# EAGLE design queencontroller (EAGLE 7.3.0)
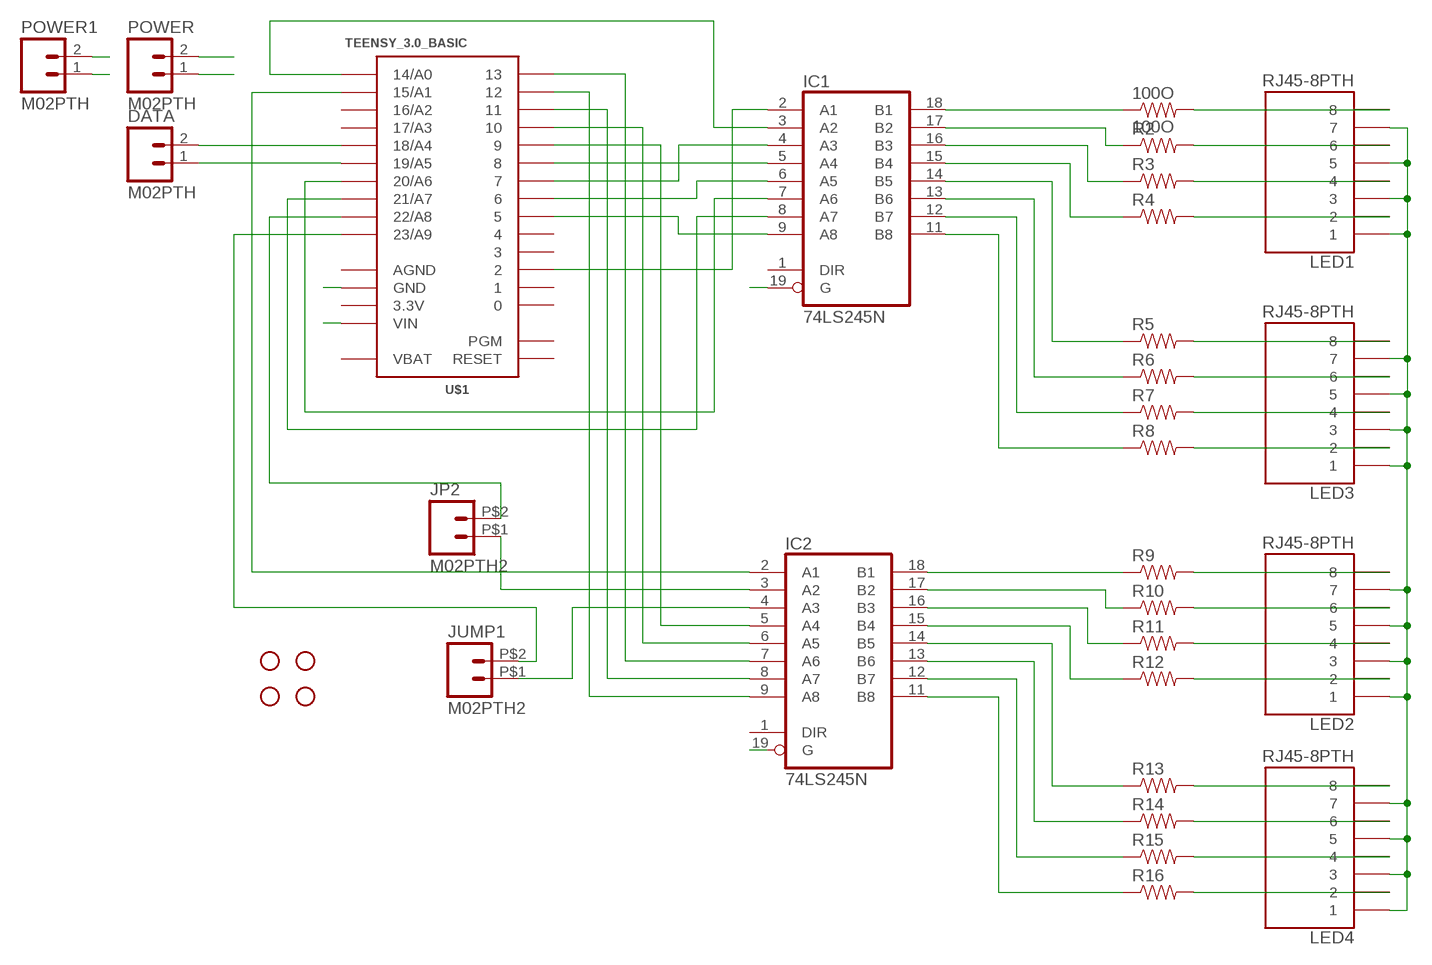
[diagram p0: schematic, sheet 1]

## Parts
100O  100O  RESISTOR1206  [1206]
DATA  M02PTH  [1X02]
IC1  74LS245N  [DIL20]
IC2  74LS245N  [DIL20]
JP2  M02PTH2  [1X02_BIG]
JUMP1  M02PTH2  [1X02_BIG]
LED1  RJ45-8PTH  [RJ45-8]
LED2  RJ45-8PTH  [RJ45-8]
LED3  RJ45-8PTH  [RJ45-8]
LED4  RJ45-8PTH  [RJ45-8]
POWER  M02PTH  [1X02]
POWER1  M02PTH  [1X02]
R2  RESISTOR1206  [1206]
R3  RESISTOR1206  [1206]
R4  RESISTOR1206  [1206]
R5  RESISTOR1206  [1206]
R6  RESISTOR1206  [1206]
R7  RESISTOR1206  [1206]
R8  RESISTOR1206  [1206]
R9  RESISTOR1206  [1206]
R10  RESISTOR1206  [1206]
R11  RESISTOR1206  [1206]
R12  RESISTOR1206  [1206]
R13  RESISTOR1206  [1206]
R14  RESISTOR1206  [1206]
R15  RESISTOR1206  [1206]
R16  RESISTOR1206  [1206]
STANDOFF1  STAND-OFF  [STAND-OFF]
STANDOFF2  STAND-OFF  [STAND-OFF]
STANDOFF3  STAND-OFF  [STAND-OFF]
STANDOFF4  STAND-OFF  [STAND-OFF]
U$1  TEENSY_3.0_BASIC  [TEENSY_3.0_BASIC]

## Nets
GND: IC1.19(G) IC2.19(G) LED1.1 LED1.3 LED1.5 LED1.7 LED2.1 LED2.3 LED2.5 LED2.7 LED3.1 LED3.3 LED3.5 LED3.7 LED4.1 LED4.3 LED4.5 LED4.7 POWER1.1 POWER.1 U$1.GND U$1.GND1(GND)
JMP1: JUMP1.P$2 U$1.23/A9
JMP2: JP2.P$2 U$1.22/A8
N$1: 100O.2 LED1.8
N$2: LED1.6 R2.2
N$3: LED1.4 R3.2
N$4: LED1.2 R4.2
N$5: LED3.8 R5.2
N$6: LED3.6 R6.2
N$7: LED3.4 R7.2
N$8: LED3.2 R8.2
N$9: LED2.8 R9.2
N$10: LED2.6 R10.2
N$11: LED2.4 R11.2
N$12: LED2.2 R12.2
N$13: LED4.8 R13.2
N$14: LED4.6 R14.2
N$15: LED4.4 R15.2
N$16: LED4.2 R16.2
N$17: IC1.2(A1) U$1.2
N$18: IC1.3(A2) U$1.14/A0
N$19: IC1.4(A3) U$1.7
N$20: IC1.5(A4) U$1.8
N$21: IC1.6(A5) U$1.6
N$22: IC1.7(A6) U$1.20/A6
N$23: IC1.8(A7) U$1.21/A7
N$24: IC1.9(A8) U$1.5
N$25: IC2.2(A1) U$1.15/A1
N$26: IC2.3(A2) JP2.P$1
N$27: IC2.4(A3) JUMP1.P$1
N$28: IC2.5(A4) U$1.9
N$29: IC2.6(A5) U$1.10
N$30: IC2.7(A6) U$1.13
N$31: IC2.8(A7) U$1.11
N$32: IC2.9(A8) U$1.12
N$33: 100O.1 IC1.18(B1)
N$34: IC1.17(B2) R2.1
N$35: IC1.16(B3) R3.1
N$36: IC1.15(B4) R4.1
N$37: IC1.14(B5) R5.1
N$38: IC1.13(B6) R6.1
N$39: IC1.12(B7) R7.1
N$40: IC1.11(B8) R8.1
N$41: IC2.18(B1) R9.1
N$42: IC2.17(B2) R10.1
N$43: IC2.16(B3) R11.1
N$44: IC2.15(B4) R12.1
N$45: IC2.14(B5) R13.1
N$46: IC2.13(B6) R14.1
N$47: IC2.12(B7) R15.1
N$48: IC2.11(B8) R16.1
SCL: DATA.1 U$1.19/A5
SDA: DATA.2 U$1.18/A4
VCC: POWER1.2 POWER.2 U$1.VIN
Unconnected: IC1.1(DIR) IC2.1(DIR) U$1.0 U$1.1 U$1.3 U$1.4 U$1.16/A2 U$1.17/A3 U$1.PGM U$1.RESET

## Power pins joined to a net without a drawn wire
3.3V: U$1.3.3V U$1.3.3V1(3.3V)
AGND: U$1.AGND
GND: IC1.10(GND) IC2.10(GND)
VBAT: U$1.VBAT
VCC: IC1.20(VCC) IC2.20(VCC)

## Library data of the parts
100O R2-R16 = SparkFun-Passives:RESISTOR: Resistor Basic schematic elements and footprints for 0603, 1206, and PTH resistors.
DATA JP2 JUMP1 POWER POWER1 = SparkFun-Connectors:M02: Standard 2-pin 0.1" header. Use with - straight break away headers ( PRT-00116) - right angle break away headers (PRT-00553) - swiss pins (PRT-00743) - machine pins (PRT-00117) - female headers (PRT-00115) Molex polarized connector foot print use with: PRT-08233 with associated crimp pins and housings. 2.54_SCREWTERM for use with PRT-10571. 3.5mm Screw Terminal footprints for PRT-08084 5mm Screw Terminal footprints for use with PRT-08432
IC1 IC2 = 74xx-us:74*245: Octal BUS TRANSCEIVER, 3-state
LED1-LED4 = SparkFun-Connectors:RJ45-8: RJ45 Jack Simple RJ45, 8-pin connection - connector for common Cat5, Cat5e, and Cat6 Ethernet cables. Footprint not yet proven in production. Connector sku is PRT-00643; Breakout PCB sku is BOB-00716.
STANDOFF1-STANDOFF4 = SparkFun-Electromechanical:STAND-OFF: #4 Stand Off This is the mechanical footprint for a #4 phillips button head screw. Use the keepout ring to avoid running the screw head into surrounding components. SKU : PRT-00447
U$1 = Teensy3.0:TEENSY_3.0_BASIC: Basic Teensy 3.0 with none of the 'inner' pins enabled. See '+4', 'AllAnalogPins", and 'AllPins' packages for additional pin holes, as needed.

## Board
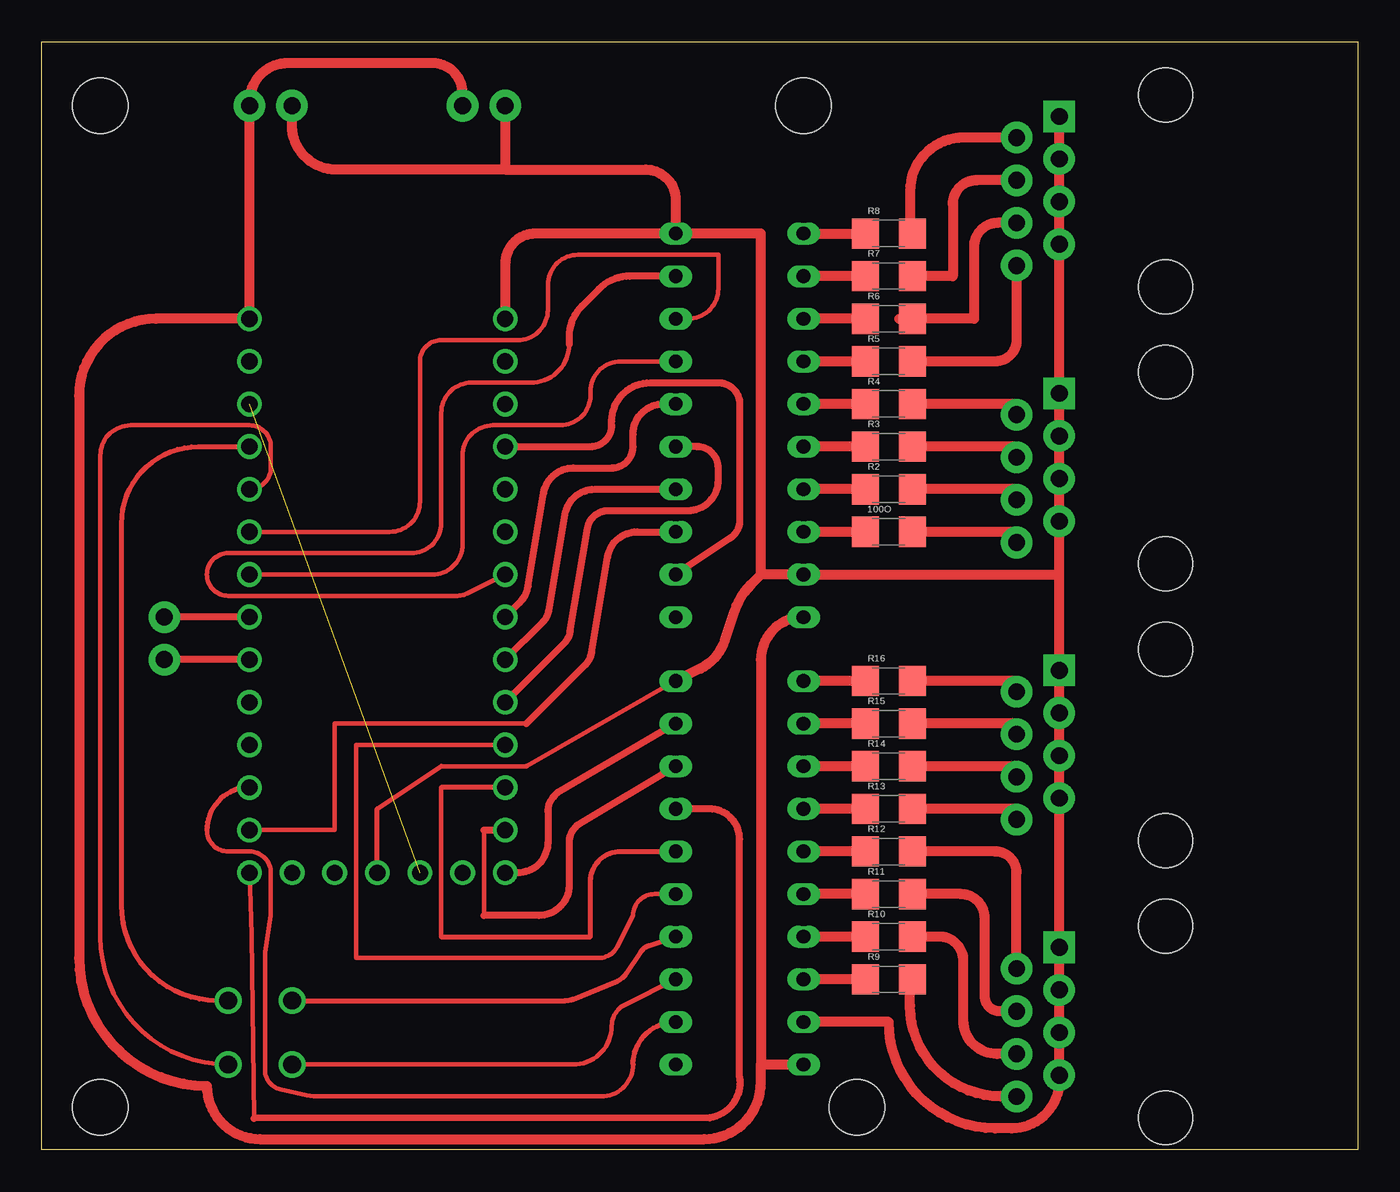
[diagram p1: board, top side]
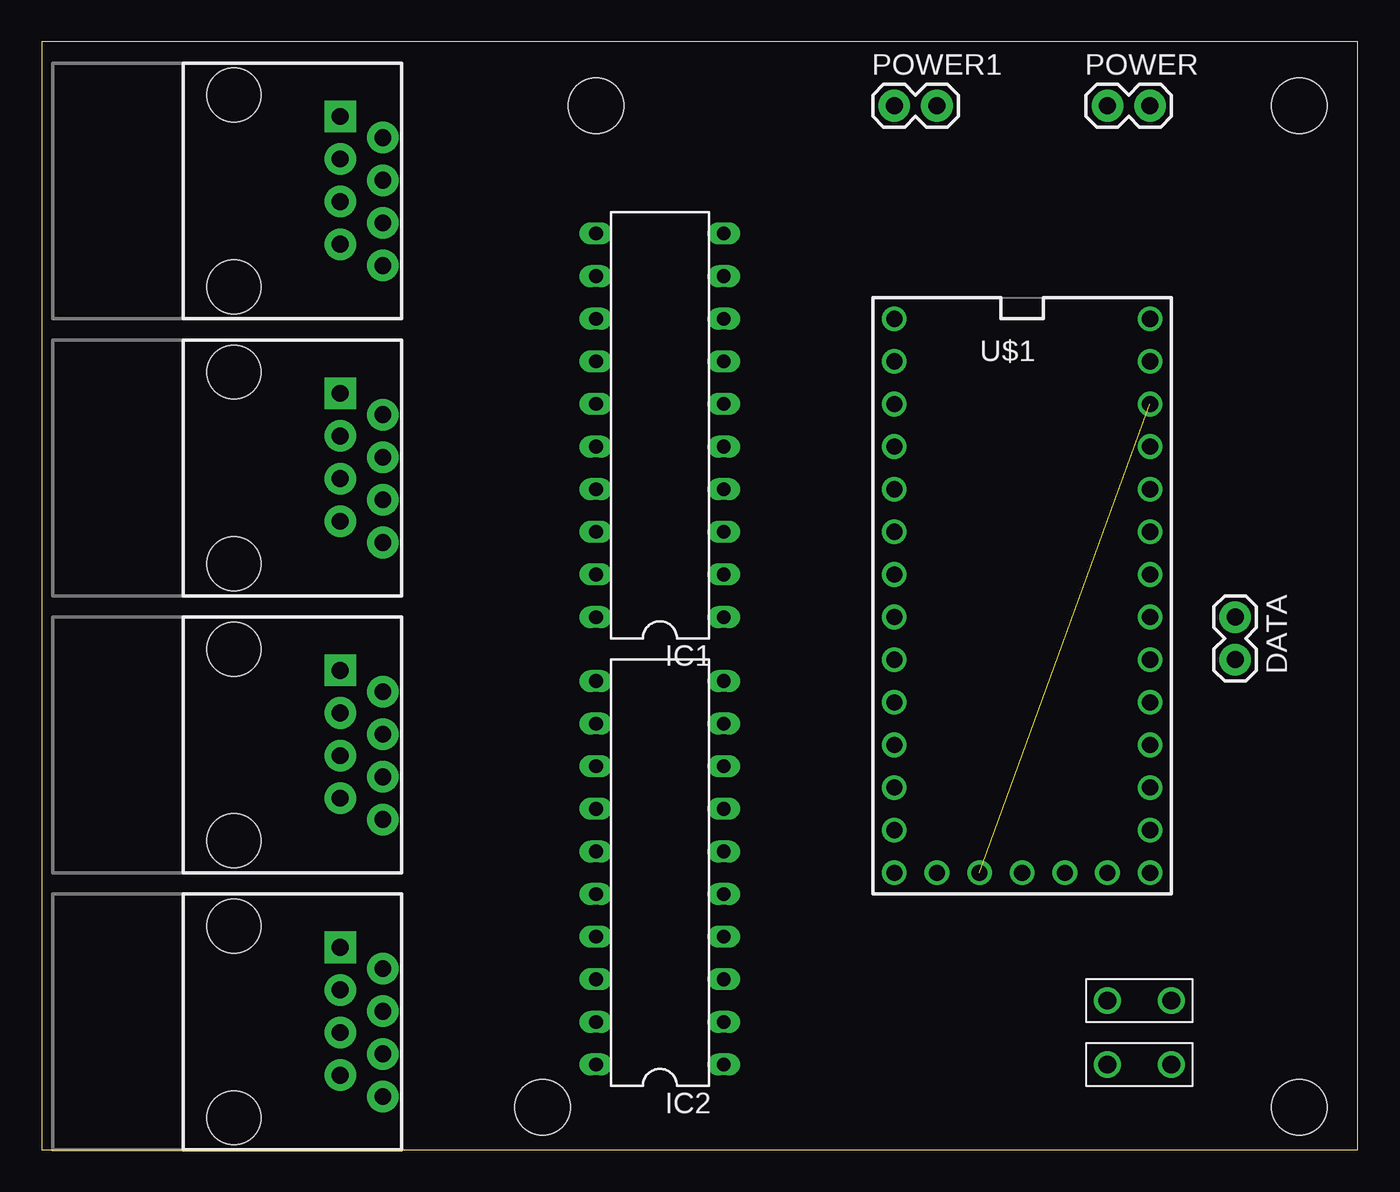
[diagram p2: board, bottom side, seen from below]

Size 78.41 x 66.03 mm. Coordinates in mm from the lower left corner, seen from the top.
Outline: 78.41,0 0,0 0,66.03 78.41,66.03 78.41,0
Copper layers (1*16): Top 0.035mm / dielectric 1.5mm / Bottom 0.035mm
Design rules "Othermill-DRC-1-64": minimum track width 8mil, minimum drill 0.8mm, track to track 0.39878125mm, track to pad 0.39878125mm, pad to pad 0.39878125mm, via to via 0.39878125mm, smd to smd 0mil, copper to edge 0mil, drill to drill 1mil, minimum pad ring 10mil, minimum via ring 10mil, stop-mask expansion 1mil, vias tented up to drill 30mil, thermal gap 10mil

### Footprints (pad centres in the part's own frame; a part is rotated, then mirrored left to right if it is on the bottom)
1206 = smd 1.6 x 1.8: 1 -1.4,0; 2 1.4,0
1X02 = drill 1.016 pad 1.88: 1 0,0; 2 2.54,0
DIL20 = drill 0.813 long: 1 -11.43,-3.81; 2 -8.89,-3.81; 3 -6.35,-3.81; 4 -3.81,-3.81; 5 -1.27,-3.81; 6 1.27,-3.81; 7 3.81,-3.81; 8 6.35,-3.81; 9 8.89,-3.81; 10 11.43,-3.81; 11 11.43,3.81; 12 8.89,3.81; 13 6.35,3.81; 14 3.81,3.81; 15 1.27,3.81; 16 -1.27,3.81; 17 -3.81,3.81; 18 -6.35,3.81; 19 -8.89,3.81; 20 -11.43,3.81
1X02_BIG = drill 1.067: P$1 0,0; P$2 3.81,0
RJ45-8 = drill 1 pad 1.88 square: 1 -4.445,6.35 | drill 1 pad 1.88: 2 -3.175,8.89; 3 -1.905,6.35; 4 -0.635,8.89; 5 0.635,6.35; 6 1.905,8.89; 7 3.175,6.35; 8 4.445,8.89 | hole 3.2: -5.715,0; 5.715,0
STAND-OFF = hole 3.302: 0,0
TEENSY_3.0_BASIC = drill 0.965: 0 -7.62,13.97; 1 -7.62,11.43; 2 -7.62,8.89; 3 -7.62,6.35; 3.3V 7.62,11.43; 3.3V1 -2.54,-16.51; 4 -7.62,3.81; 5 -7.62,1.27; 6 -7.62,-1.27; 7 -7.62,-3.81; 8 -7.62,-6.35; 9 -7.62,-8.89; 10 -7.62,-11.43; 11 -7.62,-13.97; 12 -7.62,-16.51; 13 7.62,-16.51; 14/A0 7.62,-13.97; 15/A1 7.62,-11.43; 16/A2 7.62,-8.89; 17/A3 7.62,-6.35; 18/A4 7.62,-3.81; 19/A5 7.62,-1.27; 20/A6 7.62,1.27; 21/A7 7.62,3.81; 22/A8 7.62,6.35; 23/A9 7.62,8.89; AGND 7.62,13.97; GND -7.62,16.51; GND1 0,-16.51; PGM 2.54,-16.51; RESET 5.08,-16.51; VBAT -5.08,-16.51; VIN 7.62,16.51

### Placement (x,y rotation side)
100O  50.47,36.83 0 top
DATA  7.29,31.75 270 bottom
IC1  41.58,43.18 90 bottom
IC2  41.58,16.51 90 bottom
JP2  14.91,5.08 0 bottom
JUMP1  14.91,8.89 0 bottom
LED1  66.98,40.64 270 bottom
LED2  66.98,7.62 270 bottom
LED3  66.98,57.15 270 bottom
LED4  66.98,24.13 270 bottom
POWER  14.91,62.23 0 bottom
POWER1  27.61,62.23 0 bottom
R2  50.47,39.37 0 top
R3  50.47,41.91 0 top
R4  50.47,44.45 0 top
R5  50.47,46.99 0 top
R6  50.47,49.53 0 top
R7  50.47,52.07 0 top
R8  50.47,54.61 0 top
R9  50.47,10.16 0 top
R10  50.47,12.7 0 top
R11  50.47,15.24 0 top
R12  50.47,17.78 0 top
R13  50.47,20.32 0 top
R14  50.47,22.86 0 top
R15  50.47,25.4 0 top
R16  50.47,27.94 0 top
STANDOFF1  3.48,2.54 0 top
STANDOFF2  48.57,2.54 0 top
STANDOFF3  3.48,62.23 0 top
STANDOFF4  45.39,62.23 0 top
U$1  19.99,33.02 0 bottom

### Tracks (layer width: path | path; a pad name or v marks a point on that pad's centre or on a via)
3.3V  (1 unrouted)
GND
  Top 0.254: 23.8,22.86 28.88,22.86
  Top 0.305: U$1.GND1 19.99,20.32 23.8,22.86 | IC2.10 28.88,22.86
  Top 0.61: 42.85,34.29 IC1.19 60.63,34.29 | 42.85,34.29 42.85,54.61 IC1.10 | 42.85,34.29 42.25,33.69 arc27 41.28,32.12 40.68,30.33 arc-45 39.26,28.68 IC2.10 | IC2.19 50.47,7.62 arc90 56.82,1.27 57.79,1.27 arc90 60.63,4.11 LED2.7 LED2.5 LED2.3 LED2.1 LED4.7 LED4.5 LED4.3 LED4.1 60.63,34.29 | 60.63,34.29 LED1.7 LED1.5 LED1.3 LED1.1 LED3.7 LED3.5 LED3.3 LED3.1 | POWER1.1 27.61,58.42 | 27.61,58.42 17.53,58.42 arc-90 14.91,61.04 POWER.1 | 27.61,58.42 35.97,58.42 arc-90 37.77,56.62 IC1.10 | IC1.10 29.41,54.61 arc90 27.61,52.81 U$1.GND
JMP1
  Top 0.305: JUMP1.P$2 10.43,8.89 arc-90 4.75,14.57 4.75,37.33 arc-90 9.33,41.91 U$1.23/A9
JMP2
  Top 0.254: JP2.P$2 arc-90 3.48,12.7 3.48,41.38 arc-90 5.28,43.18 12.37,43.18 arc-90 13.64,41.91 13.64,40.64 arc-90 U$1.22/A8
N$1
  Top 0.61: LED1.8 58.09,36.83 100O.2
N$2
  Top 0.61: LED1.6 58.09,39.37 R2.2
N$3
  Top 0.61: LED1.4 58.09,41.91 R3.2
N$4
  Top 0.61: LED1.2 58.09,44.45 R4.2
N$5
  Top 0.61: LED3.8 58.09,48.26 arc-90 56.82,46.99 R5.2
N$6
  Top 0.61: LED3.6 56.97,55.24 arc90 55.55,53.82 55.55,49.53 R6.2 51.11,49.53
N$7
  Top 0.61: LED3.4 55.7,57.79 arc90 54.28,56.37 54.28,52.07 R7.2
N$8
  Top 0.61: LED3.2 54.91,60.32 arc90 51.74,57.15 51.74,55.24 R8.2
N$9
  Top 0.61: LED2.8 57.16,3.18 arc-90 51.74,8.6 51.74,9.53 R9.2
N$10
  Top 0.61: LED2.6 56.92,5.71 arc-90 54.91,7.72 54.91,11.28 arc90 53.5,12.7 R10.2
N$11
  Top 0.61: LED2.4 57.08,8.26 arc-90 56.19,9.15 56.19,13.82 arc90 54.77,15.24 R11.2
N$12
  Top 0.61: LED2.2 58.09,16.51 arc90 56.82,17.78 R12.2
N$13
  Top 0.61: LED4.8 58.09,20.32 R13.2
N$14
  Top 0.61: LED4.6 58.09,22.86 R14.2
N$15
  Top 0.61: LED4.4 58.09,25.4 R15.2
N$16
  Top 0.61: LED4.2 58.09,27.94 R16.2
N$17
  Top 0.406: U$1.2 32.69,41.91 arc90 33.96,43.18 33.96,43.43 arc-90 36.25,45.72 40.31,45.72 arc-90 41.58,44.45 41.58,37.51 arc-56 41.01,36.45 IC1.2
N$18
  Top 0.254: 28.88,25.4 17.45,25.4 17.45,19.05 U$1.14/A0
  Top 0.406: 28.88,25.4 32.4,28.92 arc36 32.76,29.61 33.71,35.33 arc-81 35.48,36.83 IC1.3
N$19
  Top 0.406: U$1.7 29.86,31.46 arc36 30.22,32.15 31.17,37.87 arc-81 32.94,39.37 IC1.4
N$20
  Top 0.406: U$1.8 31.13,30.19 arc36 31.49,30.88 32.51,37.04 arc-81 33.77,38.1 38.51,38.1 arc90 40.31,39.9 40.31,40.64 arc90 39.04,41.91 IC1.5
N$21
  Top 0.406: U$1.6 28.47,32.61 arc36 28.97,33.59 29.9,39.14 arc-81 31.67,40.64 33.96,40.64 arc90 35.23,41.91 35.23,42.65 arc-90 37.03,44.45 IC1.6
N$22
  Top 0.254: IC1.7 34.49,46.99 arc90 32.69,45.19 32.69,44.98 arc-90 30.89,43.18 26.87,43.18 arc90 25.07,41.38 25.07,36.09 arc-90 23.27,34.29 U$1.20/A6
N$23
  Top 0.254: IC1.8 38.51,49.53 arc90 40.31,51.33 40.31,53.34 31.95,53.34 arc90 30.15,51.54 30.15,50.06 arc-90 28.35,48.26 23.8,48.26 arc90 22.53,46.99 22.53,38.63 arc-90 20.73,36.83 U$1.21/A7
N$24
  Top 0.254: 31.42,48.01 arc-90 29.13,45.72 28.88,45.72 25.6,45.72 arc90 23.8,43.92 23.8,37.36 arc-90 22,35.56 11.1,35.56 arc90 9.83,34.29 arc90 11.1,33.02 24.77,33.02 arc27 25.34,33.15 U$1.5
  Top 0.406: IC1.9 35.04,52.07 arc45 33.19,51.3 32.19,50.3 arc45 31.42,48.45 31.42,48.01
N$25
  Top 0.254: 9.83,19.05 arc90 11.1,17.78 12.37,17.78 arc-90 13.64,16.51 13.64,13.97 13.29,11.78 13.29,4.75 arc78 14.21,3.61 15.78,3.26 arc14 16.58,3.19 33.33,3.18 arc90 35.23,5.08
  Top 0.305: U$1.15/A1 arc90 9.83,19.05 | 35.23,5.08 arc-90 IC2.2
N$26
  Top 0.254: IC2.3 34.75,8.65 arc63 33.96,7.38 arc-90 31.66,5.08 JP2.P$1
N$27
  Top 0.305: JUMP1.P$1 31.18,8.89 arc22 31.65,8.98 34.19,10 arc35 34.84,10.53 35.69,11.81 arc-38 36.16,12.16 IC2.4
N$28
  Top 0.254: IC2.5 36.5,15.24 arc90 35.23,13.97 34.31,12.13 arc-63 33.18,11.43 18.72,11.43 18.72,24.13 U$1.9
N$29
  Top 0.254: 23.8,21.59 23.8,12.7
  Top 0.305: U$1.10 23.8,21.59 | 23.8,12.7 32.69,12.7 32.69,15.98 arc-90 34.49,17.78 IC2.6
N$30
  Top 0.254: 12.64,1.87 12.51,12.82 U$1.13
  Top 0.406: IC2.7 39.78,20.32 arc-90 41.58,18.52 41.58,4.33 arc-90 39.79,1.9 12.64,1.87
N$31
  Top 0.254: 26.34,13.97 26.34,19.05
  Top 0.406: IC2.8 32.04,19.42 arc59 31.42,18.33 31.42,15.77 arc-90 29.62,13.97 26.34,13.97 | 26.34,19.05 U$1.11
N$32
  Top 0.406: IC2.9 30.85,21.37 arc60 30.15,20.14 30.15,18.31 arc-90 28.35,16.51 U$1.12
N$33
  Top 0.61: 100O.1 IC1.18
N$34
  Top 0.61: R2.1 IC1.17
N$35
  Top 0.61: R3.1 IC1.16
N$36
  Top 0.61: R4.1 IC1.15
N$37
  Top 0.61: R5.1 IC1.14
N$38
  Top 0.61: R6.1 IC1.13
N$39
  Top 0.61: R7.1 IC1.12
N$40
  Top 0.61: IC1.11 R8.1 49.2,54.61
N$41
  Top 0.61: R9.1 IC2.18
N$42
  Top 0.61: R10.1 IC2.17
N$43
  Top 0.61: R11.1 IC2.16
N$44
  Top 0.61: R12.1 IC2.15
N$45
  Top 0.61: R13.1 IC2.14
N$46
  Top 0.61: R14.1 IC2.13
N$47
  Top 0.61: R15.1 IC2.12
N$48
  Top 0.61: R16.1 IC2.11
SCL
  Top 0.406: U$1.19/A5 DATA.1
SDA
  Top 0.406: U$1.18/A4 DATA.2
VCC
  Top 0.61: IC1.20 arc90 42.85,29.21 42.85,5.08 | 42.85,5.08 IC2.20 | POWER1.2 25.07,62.97 arc90 23.27,64.77 14.66,64.77 arc90 12.37,62.48 POWER.2 U$1.VIN 6.79,49.53 arc90 2.21,44.95 2.21,11.43 arc90 9.83,3.81 arc90 13,0.64 39.47,0.64 arc90 42.85,4.02 42.85,5.08